# Altium schematic sheet AD9363.SchDoc
size A3; SheetNumber: 6; SheetTotal: 14; SPICEModelCachePHHWHPTQ: <root> / <DocumentId>PHHWHPTQ</DocumentId> / <CacheFrame Number="0"> / <Model Name="emk105bj105_v-f" Kind="CKT"> / <Text>* EMK105BJ105_V-F     SPICE MODEL  ( General Type ) / *-------------------------------------------------------------------------------------------------------- / * Model Generated by TAIYO YUDEN Corporation (http://www.ty-top.com) / * Version 1.0 / * TAIYO YUDEN Control No. 170508_130520 / * Copyright(c) 2012 TAIYO YUDEN CO.,LTD. All Rights Reserved. / *-------------------------------------------------------------------------------------------------------- / * / * Products Name : Multilayer Ceramic Capacitors / * / * Characteristics : / *     Capacitance : 1 uF , Rated Voltage : 16V , TCC : X5R / *     Case Size : 1.0 x 0.5 / 0.039 x 0.02 [mm/inch] , Thickness : 0.5 / 0.02 [mm/inch] / *     (Conditions: Temperature = 25 degC , DC Bias Current/Voltage = 0A / 0V) / * / * Frequency Range : 40Hz - 3GHz / * / * External Node Assignments : / * / *  1  o---| |---o  2 / * / *-------------------------------------------------------------------------------------------------------- / .SubCkt EMK105BJ105_V-F 1 2 / **************************** / C0 1 110 0.68309u / Cm 1 101 0.26053u / C1 101 102 0.94076u / Rc1 101 102 1.9029k / C2 102 103 0.66707u / Rc2 102 103 120.36 / C3 103 110 0.57203u / Rc3 103 110 2.1097 / C2m 1 301 0.1871u / C21 301 302 3.2494u / Rc21 301 302 1.1117k / C22 302 303 2.1014u / Rc22 302 303 1.484k / C23 303 304 2.1172u / Rc23 303 304 1.3876k / C24 304 305 0.75729u / Rc24 304 305 332.59 / C25 305 306 0.94401u / Rc25 305 306 249.09 / C26 306 307 0.34674u / Rc26 306 307 28.352 / C27 307 308 0.37158u / Rc27 307 308 19.989 / C28 308 309 0.17933u / Rc28 308 309 31.748 / C29 309 110 0.016445u / Rc29 309 110 1.0592 / Rp0 1 110 100Meg / L0 110 120 0.2216n / Lm 120 130 0.1509n / L1 120 121 0.12659n / RL1 121 130 0.85161 / L2 120 122 0.15996n / RL2 122 130 0.42469 / L3 120 123 7.9543n / RL3 123 130 0.54643m / CR 120 124 0.24334u / LR 124 125 0.090738n / RR 125 130 68.076m / CL 130 140 2.7354p / LL 130 140 0.10762n / RL 130 140 50.614 / Rs 140 2 7.5416m / **************************** / .ends EMK105BJ105_V-F</Text> / </Model> / </CacheFrame> / </root>
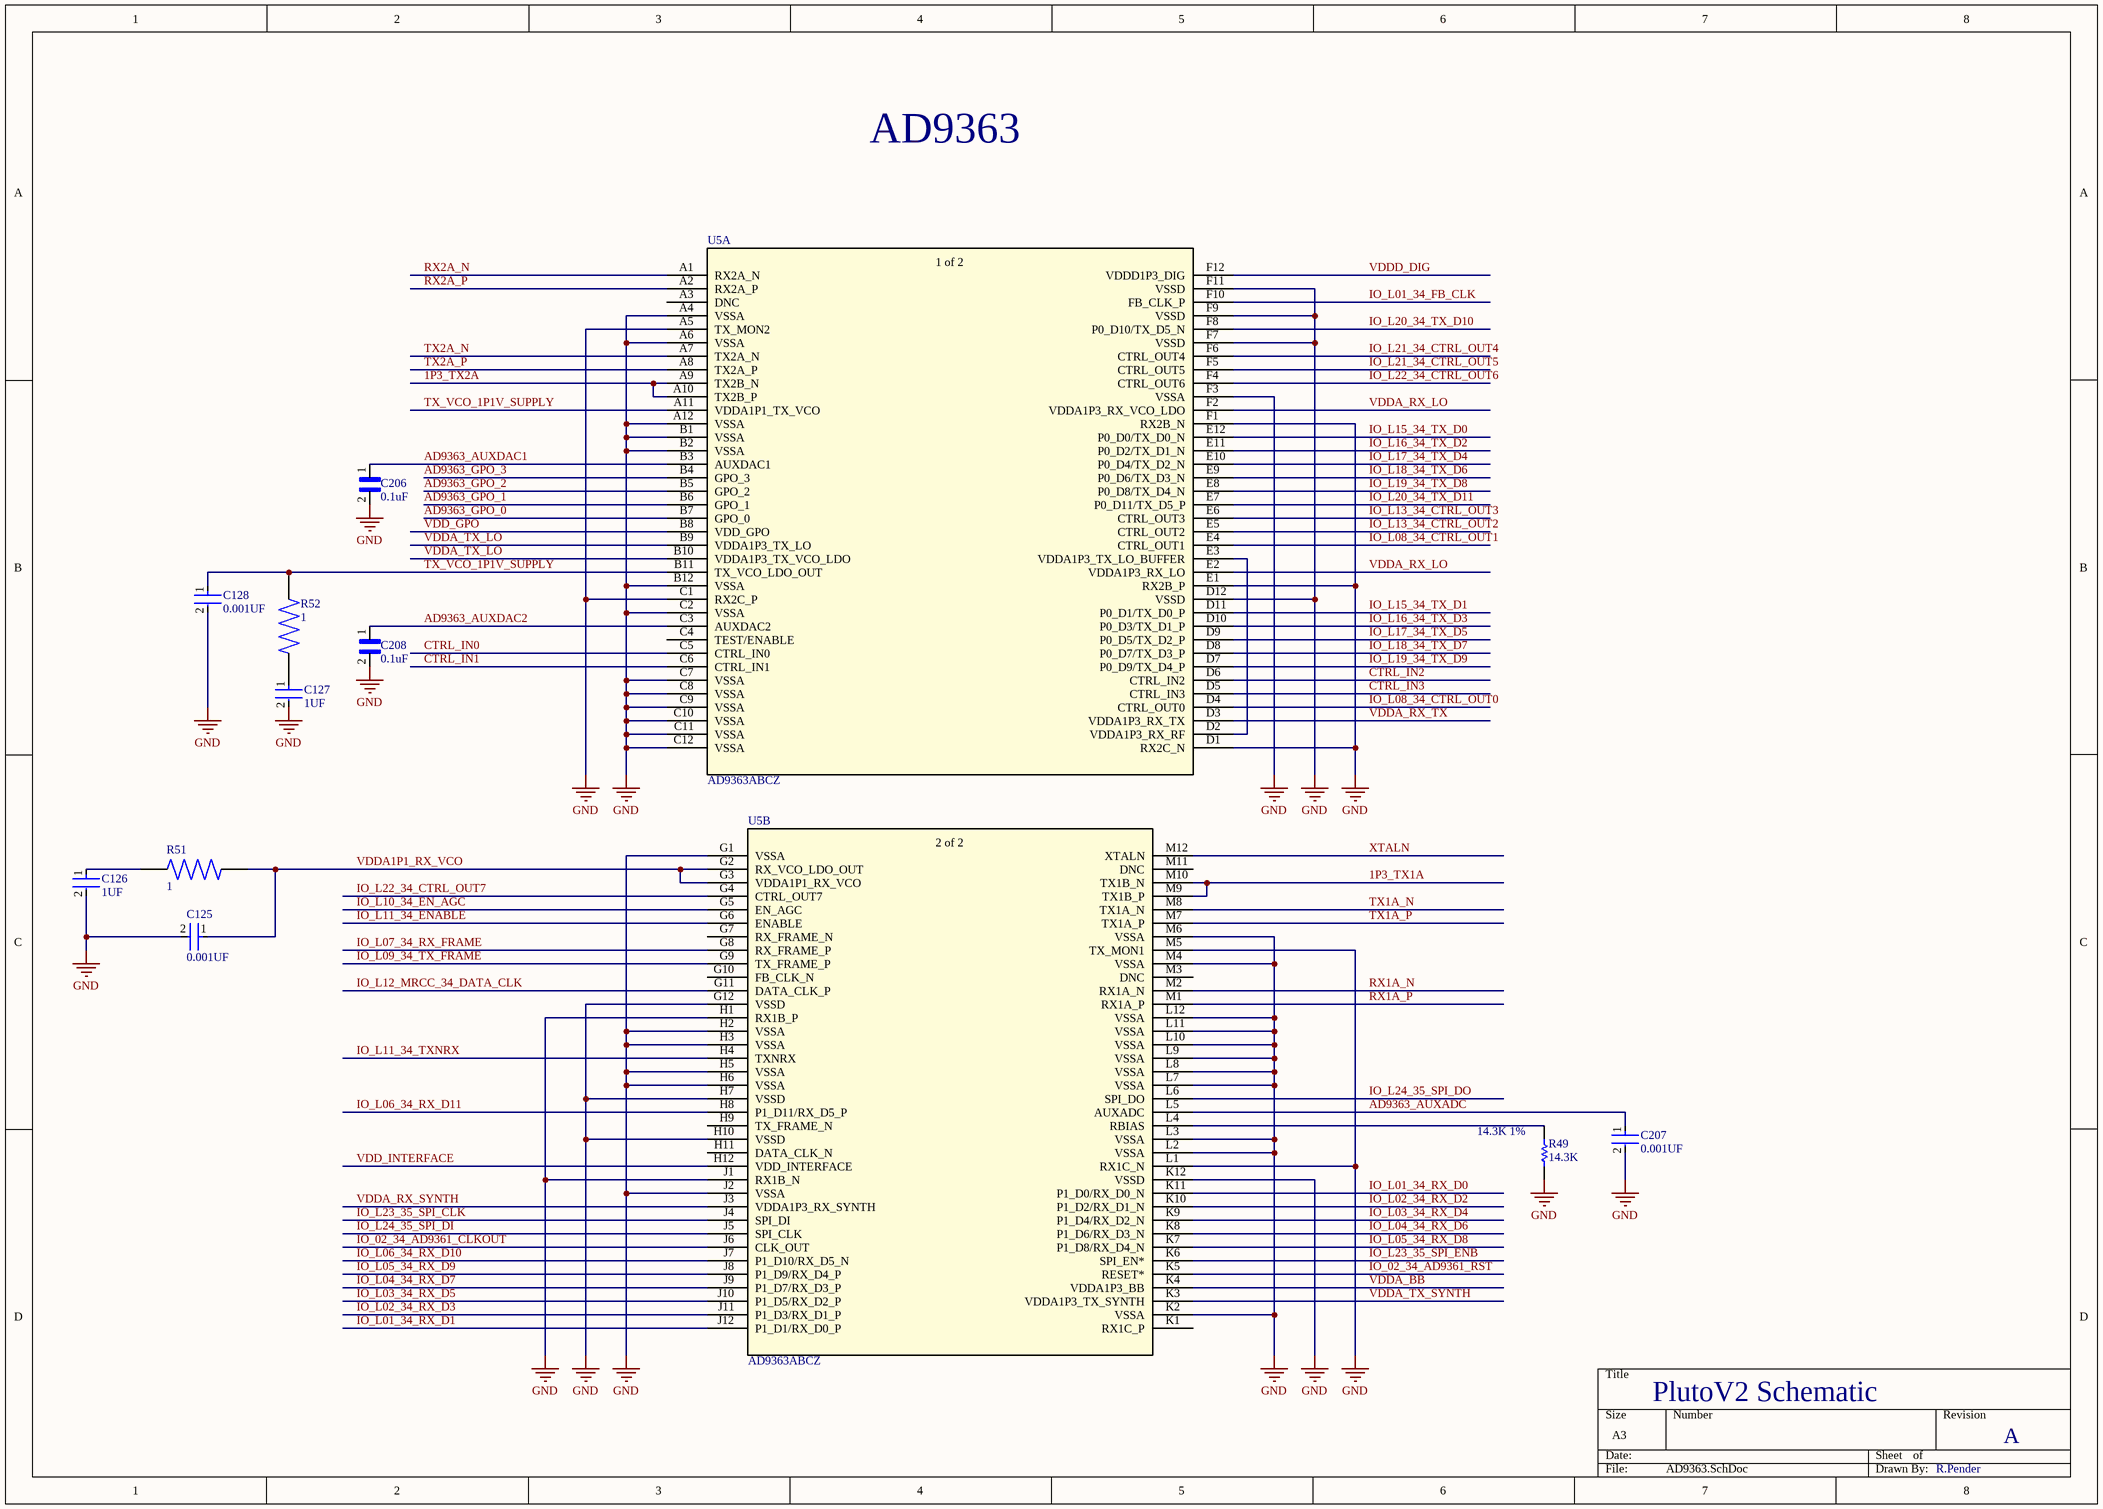
[diagram p0: AD9363.SchDoc]

## Parts
C125  0.001UF  [FP-GRM033-0_03-MFG]
C126  1UF  [FP-0402-L_1_0_0_05-W_0_5-IPC_A]
C127  1UF  [FP-0402-L_1_0_0_05-W_0_5-IPC_A]
C128  0.001UF  [FP-GRM033-0_03-MFG]
C206  0.1uF  [CAPC0603X33N]
C207  0.001UF  [FP-GRM033-0_03-MFG]
C208  0.1uF  [CAPC0603X33N]
R49  14.3K  [RESC0603X26X15NL03T05]
R51  1  [RESC0603X26N]
R52  1  [RESC0603X26N]
U5  AD9363ABCZ  [BGA144C80P12X12_1000X1000X170]  (parts A,B of 2)

## Nets
GND: C125.2 C126.2 C127.2 C128.2 C206.2 C207.2 C208.2 R49.2 U5.A4(VSSA) U5.A5(TX_MON2) U5.A6(VSSA) U5.A12(VSSA) U5.B1(VSSA) U5.B2(VSSA) U5.B12(VSSA) U5.C1(RX2C_P) U5.C2(VSSA) U5.C7(VSSA) U5.C8(VSSA) U5.C9(VSSA) U5.C10(VSSA) U5.C11(VSSA) U5.C12(VSSA) U5.D1(RX2C_N) U5.D12(VSSD) U5.E1(RX2B_P) U5.F1(RX2B_N) U5.F3(VSSA) U5.F7(VSSD) U5.F9(VSSD) U5.F11(VSSD) U5.G1(VSSA) U5.G12(VSSD) U5.H1(RX1B_P) U5.H2(VSSA) U5.H3(VSSA) U5.H5(VSSA) U5.H6(VSSA) U5.H7(VSSD) U5.H10(VSSD) U5.J1(RX1B_N) U5.J2(VSSA) U5.K2(VSSA) U5.K12(VSSD) U5.L1(RX1C_N) U5.L2(VSSA) U5.L3(VSSA) U5.L7(VSSA) U5.L8(VSSA) U5.L9(VSSA) U5.L10(VSSA) U5.L11(VSSA) U5.L12(VSSA) U5.M4(VSSA) U5.M5(TX_MON1) U5.M6(VSSA)
1P3_TX1A: U5.M9(TX1B_P) U5.M10(TX1B_N)
1P3_TX2A: U5.A9(TX2B_N) U5.A10(TX2B_P)
AD9363_AUXADC: C207.1 U5.L5(AUXADC)
AD9363_AUXDAC1: C206.1 U5.B3(AUXDAC1)
AD9363_AUXDAC2: C208.1 U5.C3(AUXDAC2)
AD9363_GPO_0: U5.B7(GPO_0)
AD9363_GPO_1: U5.B6(GPO_1)
AD9363_GPO_2: U5.B5(GPO_2)
AD9363_GPO_3: U5.B4(GPO_3)
CTRL_IN0: U5.C5(CTRL_IN0)
CTRL_IN1: U5.C6(CTRL_IN1)
CTRL_IN2: U5.D6(CTRL_IN2)
CTRL_IN3: U5.D5(CTRL_IN3)
IO_02_34_AD9361_CLKOUT: U5.J6(CLK_OUT)
IO_02_34_AD9361_RST: U5.K5(RESET*)
IO_L01_34_FB_CLK: U5.F10(FB_CLK_P)
IO_L01_34_RX_D0: U5.K11(P1_D0/RX_D0_N)
IO_L01_34_RX_D1: U5.J12(P1_D1/RX_D0_P)
IO_L02_34_RX_D2: U5.K10(P1_D2/RX_D1_N)
IO_L02_34_RX_D3: U5.J11(P1_D3/RX_D1_P)
IO_L03_34_RX_D4: U5.K9(P1_D4/RX_D2_N)
IO_L03_34_RX_D5: U5.J10(P1_D5/RX_D2_P)
IO_L04_34_RX_D6: U5.K8(P1_D6/RX_D3_N)
IO_L04_34_RX_D7: U5.J9(P1_D7/RX_D3_P)
IO_L05_34_RX_D8: U5.K7(P1_D8/RX_D4_N)
IO_L05_34_RX_D9: U5.J8(P1_D9/RX_D4_P)
IO_L06_34_RX_D10: U5.J7(P1_D10/RX_D5_N)
IO_L06_34_RX_D11: U5.H8(P1_D11/RX_D5_P)
IO_L07_34_RX_FRAME: U5.G8(RX_FRAME_P)
IO_L08_34_CTRL_OUT0: U5.D4(CTRL_OUT0)
IO_L08_34_CTRL_OUT1: U5.E4(CTRL_OUT1)
IO_L09_34_TX_FRAME: U5.G9(TX_FRAME_P)
IO_L10_34_EN_AGC: U5.G5(EN_AGC)
IO_L11_34_ENABLE: U5.G6(ENABLE)
IO_L11_34_TXNRX: U5.H4(TXNRX)
IO_L12_MRCC_34_DATA_CLK: U5.G11(DATA_CLK_P)
IO_L13_34_CTRL_OUT2: U5.E5(CTRL_OUT2)
IO_L13_34_CTRL_OUT3: U5.E6(CTRL_OUT3)
IO_L15_34_TX_D0: U5.E12(P0_D0/TX_D0_N)
IO_L15_34_TX_D1: U5.D11(P0_D1/TX_D0_P)
IO_L16_34_TX_D2: U5.E11(P0_D2/TX_D1_N)
IO_L16_34_TX_D3: U5.D10(P0_D3/TX_D1_P)
IO_L17_34_TX_D4: U5.E10(P0_D4/TX_D2_N)
IO_L17_34_TX_D5: U5.D9(P0_D5/TX_D2_P)
IO_L18_34_TX_D6: U5.E9(P0_D6/TX_D3_N)
IO_L18_34_TX_D7: U5.D8(P0_D7/TX_D3_P)
IO_L19_34_TX_D8: U5.E8(P0_D8/TX_D4_N)
IO_L19_34_TX_D9: U5.D7(P0_D9/TX_D4_P)
IO_L20_34_TX_D10: U5.F8(P0_D10/TX_D5_N)
IO_L20_34_TX_D11: U5.E7(P0_D11/TX_D5_P)
IO_L21_34_CTRL_OUT4: U5.F6(CTRL_OUT4)
IO_L21_34_CTRL_OUT5: U5.F5(CTRL_OUT5)
IO_L22_34_CTRL_OUT6: U5.F4(CTRL_OUT6)
IO_L22_34_CTRL_OUT7: U5.G4(CTRL_OUT7)
IO_L23_35_SPI_CLK: U5.J4(SPI_DI)
IO_L23_35_SPI_ENB: U5.K6(SPI_EN*)
IO_L24_35_SPI_DI: U5.J5(SPI_CLK)
IO_L24_35_SPI_DO: U5.L6(SPI_DO)
RX1A_N: U5.M2(RX1A_N)
RX1A_P: U5.M1(RX1A_P)
RX2A_N: U5.A1(RX2A_N)
RX2A_P: U5.A2(RX2A_P)
TX1A_N: U5.M8(TX1A_N)
TX1A_P: U5.M7(TX1A_P)
TX2A_N: U5.A7(TX2A_N)
TX2A_P: U5.A8(TX2A_P)
TX_VCO_1P1V_SUPPLY: C128.1 R52.1 U5.A11(VDDA1P1_TX_VCO) U5.B11(TX_VCO_LDO_OUT)
VDD_GPO: U5.B8(VDD_GPO)
VDD_INTERFACE: U5.H12(VDD_INTERFACE)
VDDA1P1_RX_VCO: C125.1 R51.2 U5.G2(RX_VCO_LDO_OUT) U5.G3(VDDA1P1_RX_VCO)
VDDA_BB: U5.K4(VDDA1P3_BB)
VDDA_RX_LO: U5.E2(VDDA1P3_RX_LO) U5.F2(VDDA1P3_RX_VCO_LDO)
VDDA_RX_SYNTH: U5.J3(VDDA1P3_RX_SYNTH)
VDDA_RX_TX: U5.D3(VDDA1P3_RX_TX)
VDDA_TX_LO: U5.B9(VDDA1P3_TX_LO) U5.B10(VDDA1P3_TX_VCO_LDO)
VDDA_TX_SYNTH: U5.K3(VDDA1P3_TX_SYNTH)
VDDD_DIG: U5.F12(VDDD1P3_DIG)
XTALN: U5.M12(XTALN)
NetC126_1: C126.1 R51.1
NetC127_1: C127.1 R52.2
NetR49_1: R49.1 U5.L4(RBIAS)
NetU5_D2: U5.D2(VDDA1P3_RX_RF) U5.E3(VDDA1P3_TX_LO_BUFFER)

Not connected (* = marked no-connect by the designer): U5 A3(DNC) C4(TEST/ENABLE) G7(RX_FRAME_N) G10(FB_CLK_N) H9(TX_FRAME_N) H11(DATA_CLK_N) K1(RX1C_P) M3(DNC) M11(DNC)

## Notes on the sheet
- AD9363
- (near R49) 14.3K 1%
- PlutoV2 Schematic
- A
- R.Pender
- (in symbol AD9363ABCZ, part A) 1 of 2
- (in symbol AD9363ABCZ, part B) 2 of 2

## Library data of the parts
C125 C128 C207 = CMP-2010-01706-2: Chip Multilayer Ceramic Capacitors for General Purpose, 0201, 1000pF, X7R, 15%, 10%, 25V; Capacitance: 1nF; Max Operating Temperature: 125°C; Material: Ceramic; Lead Free: Lead Free; Radiation Hardening: No; Dielectric: X7R; Height: 0.3mm; Mount: Surface Mount; Packaging: Tape and Reel; Termination: SMD/SMT; Thickness: 0.013inch; Case Code (Metric): 0603; Tolerance: 10%; Voltage Rating (DC): 25V; REACH SVHC: No SVHC; Package Quantity: 1; Depth: 0.3mm; Voltage: 25V; Case/Package: 0201; Case Code (Imperial): 0201; Voltage Rating: 25V; Min Operating Temperature: -55°C; Length: 0.6mm; Width: 0.012inch
C126 C127 = CMP-14477-000104-2: None; Tolerance: 10%; Voltage Rating: 16V; Dielectric: X5R; Packaging: Tape and Reel; Depth: 0.5mm; Mount: Surface Mount; Thickness: 0.022inch; Package Quantity: 1; Min Operating Temperature: -55°C; Series: M; Voltage Rating (DC): 16V; Termination: SMD/SMT; Case/Package: 0402; Number of Pins: 2; Case Code (Imperial): 0402; Capacitance: 1uF; Length: 1mm; Halogen Free: Halogen Free; Case Code (Metric): 1005; Width: 0.02inch; RoHS Compliant: Yes; Radiation Hardening: No; Max Operating Temperature: 85°C; Height: 0.5mm; Construction: Flat
C206 C208 = GRM033R61C104ME84D: CAP 0.1UF 16VDC X5R 20% SMD 0201 PAPER TAPE; Package: None; Price: None; Value: *; MP: GRM033R61C104ME84D; Availability: Unavailable
R49 = CMP-1010-00545-2: Manufacturer: Panasonic; Part Number: ERJ-1GNF1432C
R51 R52 = RMCF0201FT1R00: Package: None; Price: None; Value: *; MP: RMCF0201FT1R00; Availability: Unavailable
U5 = AD9363ABCZ: No Description Available; Mfr_Name: Analog Devices Inc; Copyright: Copyright (C) 2022 Ultra Librarian. All rights reserved.; Manufacturer_Part_Number: AD9363ABCZ; Digi-Key_Part_Number_1: AD9363ABCZ-ND; RefDes: RefDes; Type: DEV